# EAGLE design lcd (EAGLE 7.2.0)
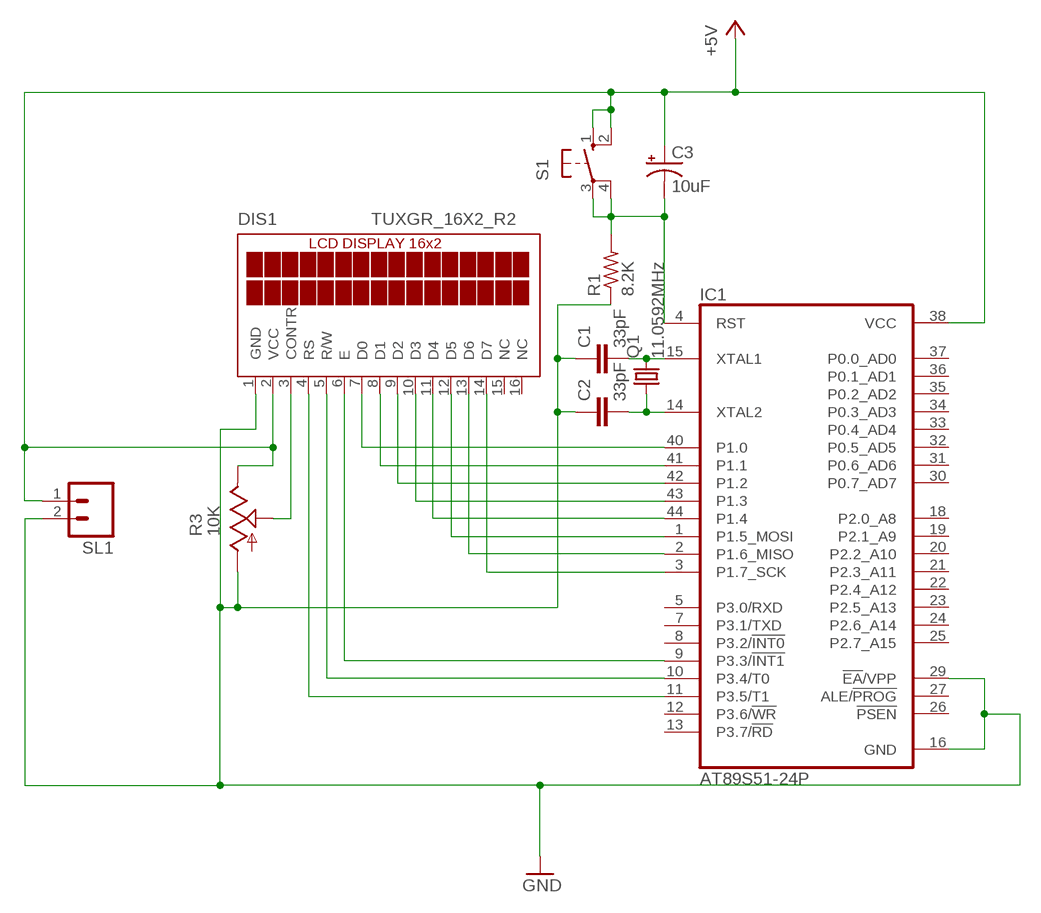
[diagram p0: schematic, sheet 1]

## Parts
C1  33pF  C-EUC1206K  [C1206K]
C2  33pF  C-EUC1206K  [C1206K]
C3  10uF  CPOL-US140CLH-1010  [140CLH-1010]
DIS1  TUXGR_16X2_R2  [TUXGR_16X2_R2]
IC1  AT89S51-24P  [TQFP44]
Q1  11.0592MHz  CRYSTALTC26V  [TC26V]
R1  8.2K  R-US_M1206  [M1206]
R3  10K  TRIM_US-B25U  [B25U]
S1  10-XX  [B3F-10XX]
SL1  MA02  [02PA]

## Nets
+5V: C3.+ DIS1.2(VCC) IC1.38(VCC) R3.E S1.1(S) S1.2(S1) SL1.1
GND: C1.1 C2.1 DIS1.1(GND) IC1.16(GND) IC1.29(!EA!/VPP) R1.1 R3.A SL1.2
N$1: C1.2 IC1.15(XTAL1) Q1.2
N$2: C2.2 IC1.14(XTAL2) Q1.1
N$3: DIS1.5(R/W) IC1.10(P3.4/T0)
N$4: DIS1.7(D0) IC1.40(P1.0)
N$5: DIS1.6(E) IC1.9(P3.3/!INT1)
N$6: DIS1.8(D1) IC1.41(P1.1)
N$7: DIS1.9(D2) IC1.42(P1.2)
N$9: DIS1.4(RS) IC1.11(P3.5/T1)
N$10: DIS1.10(D3) IC1.43(P1.3)
N$11: DIS1.11(D4) IC1.44(P1.4)
N$12: DIS1.12(D5) IC1.1(P1.5_MOSI)
N$13: DIS1.13(D6) IC1.2(P1.6_MISO)
N$14: DIS1.14(D7) IC1.3(P1.7_SCK)
N$15: DIS1.3(CONTR) R3.S
N$18: C3.- IC1.4(RST) R1.2 S1.3(P) S1.4(P1)
Unconnected: DIS1.15(NC) DIS1.16(NC) IC1.5(P3.0/RXD) IC1.7(P3.1/TXD) IC1.8(P3.2/!INT0) IC1.12(P3.6/!WR) IC1.13(P3.7/!RD) IC1.18(P2.0_A8) IC1.19(P2.1_A9) IC1.20(P2.2_A10) IC1.21(P2.3_A11) IC1.22(P2.4_A12) IC1.23(P2.5_A13) IC1.24(P2.6_A14) IC1.25(P2.7_A15) IC1.26(!PSEN) IC1.27(ALE/!PROG) IC1.30(P0.7_AD7) IC1.31(P0.6_AD6) IC1.32(P0.5_AD5) IC1.33(P0.4_AD4) IC1.34(P0.3_AD3) IC1.35(P0.2_AD2) IC1.36(P0.1_AD1) IC1.37(P0.0_AD0)

## Power pins joined to a net without a drawn wire
GND: IC1.17(GND)

## Library data of the parts
C1 C2 = rcl:C-EU: CAPACITOR, European symbol
C3 = rcl:CPOL-US: POLARIZED CAPACITOR, American symbol
DIS1 = display-lcd:TUXGR_16X2_R2: Tuxgraphics LCD display 16x2 characters reflective, without background light Source: tuxgr_12x2_r2.pdf; OC_FARNELL: unknown; OC_NEWARK: unknown
IC1 = atmel:AT89S51*P: 8-bit Microcontroller with 4K BytesIn-System Programmable Flash Source: http://www.atmel.com/dyn/resources/prod_documents/doc2487.pdf; OC_FARNELL: unknown; OC_NEWARK: unknown
Q1 = crystal:CRYSTAL: CRYSTAL; OC_FARNELL: unknown; OC_NEWARK: unknown
R1 = rcl:R-US_: RESISTOR, American symbol
R3 = pot:TRIM_US-: POTENTIOMETER
S1 = switch-omron:10-XX: OMRON SWITCH; MPN: B3F-1000; OC_FARNELL: 176432; OC_NEWARK: 36M3542
SL1 = con-amp-quick:MA02: AMP QUICK CONNECTOR; OC_FARNELL: unknown; OC_NEWARK: unknown

## Board
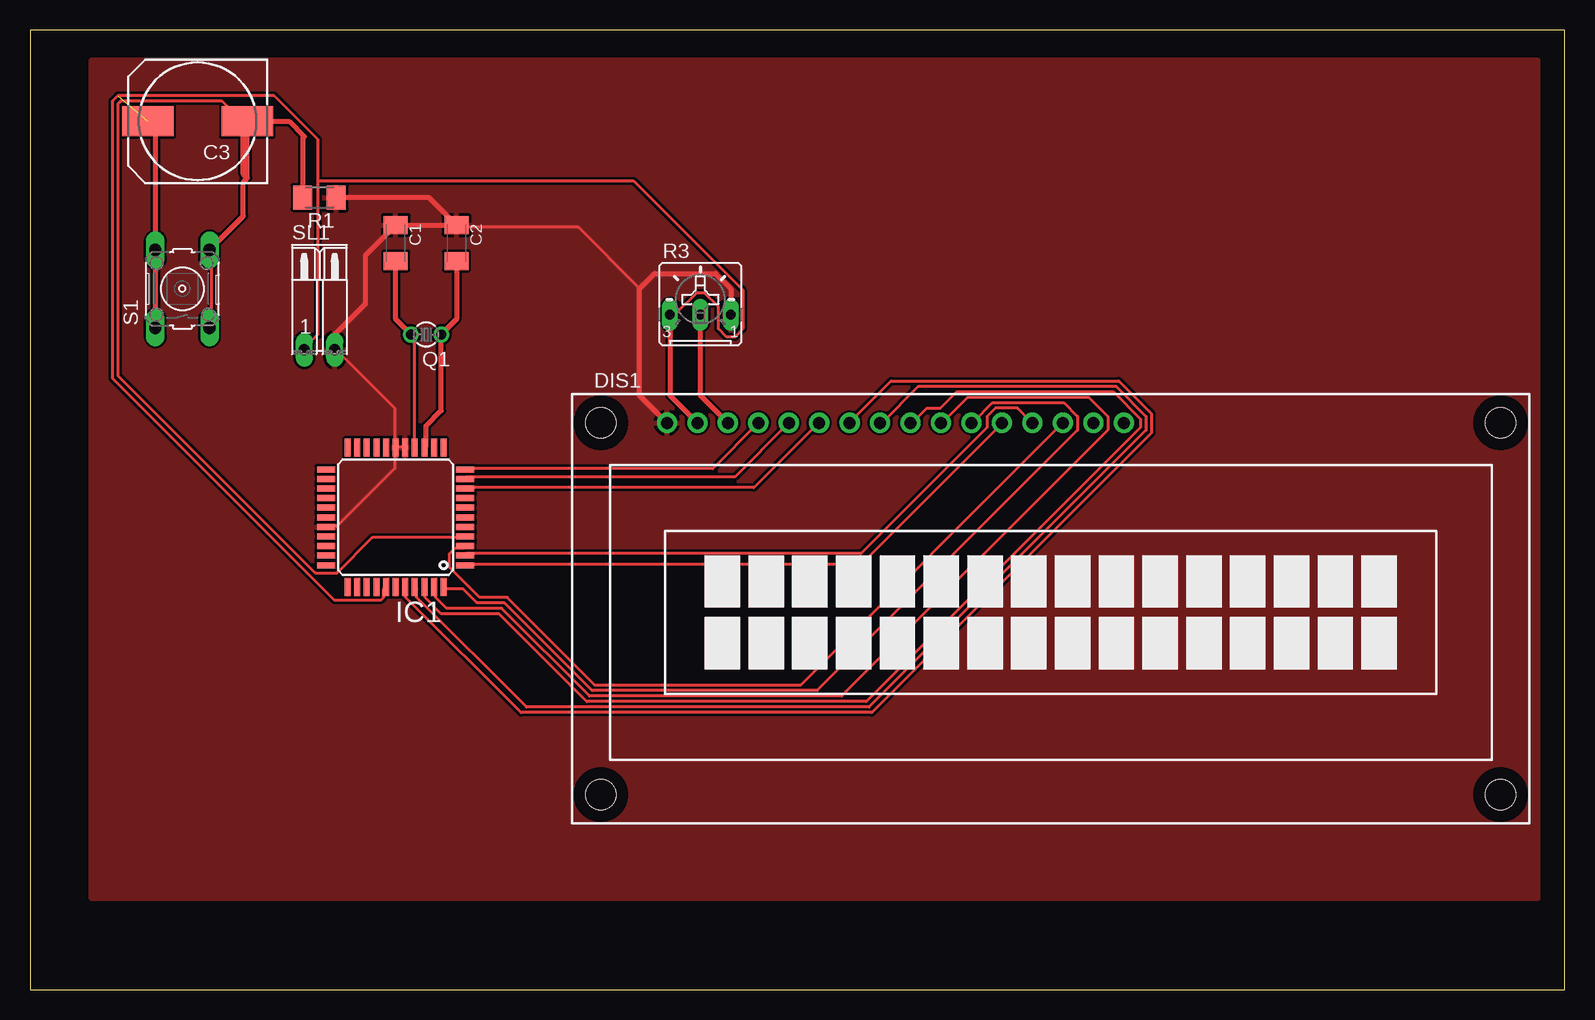
[diagram p1: board, top side]

Size 127.94 x 80 mm. Coordinates in mm from the lower left corner, seen from the top.
Outline: 0,0 127.94,0 127.94,80 0,80 0,0
Copper layers (1*16): Top 0.035mm / dielectric 1.5mm / Bottom 0.035mm
Design rules "default": minimum track width 10mil, minimum drill 24mil, track to track 8mil, track to pad 8mil, pad to pad 8mil, via to via 8mil, smd to smd 8mil, copper to edge 40mil, drill to drill 8mil, minimum pad ring 10mil, minimum via ring 8mil, stop-mask expansion 4mil, vias tented up to drill 0mil, thermal gap 10mil

### Footprints (pad centres in the part's own frame; a part is rotated, then mirrored left to right if it is on the bottom)
C1206K = smd 1.5 x 2: 1 -1.5,0; 2 1.5,0
140CLH-1010 = smd 4.3 x 2.5: + 4.15,0; - -4.15,0
TUXGR_16X2_R2 = drill 1 pad 1.676: 1 -32,15.5; 2 -29.46,15.5; 3 -26.92,15.5; 4 -24.38,15.5; 5 -21.84,15.5; 6 -19.3,15.5; 7 -16.76,15.5; 8 -14.22,15.5; 9 -11.68,15.5; 10 -9.14,15.5; 11 -6.6,15.5; 12 -4.06,15.5; 13 -1.52,15.5; 14 1.02,15.5; 15 3.56,15.5; 16 6.1,15.5 | hole 2.5: -37.5,-15.5; 37.5,-15.5; -37.5,15.5; 37.5,15.5
TQFP44 = smd 1.5 x 0.5: 1 -5.8,4; 2 -5.8,3.2; 3 -5.8,2.4; 4 -5.8,1.6; 5 -5.8,0.8; 6 -5.8,0; 7 -5.8,-0.8; 8 -5.8,-1.6; 9 -5.8,-2.4; 10 -5.8,-3.2; 11 -5.8,-4; 23 5.8,-4; 24 5.8,-3.2; 25 5.8,-2.4; 26 5.8,-1.6; 27 5.8,-0.8; 28 5.8,0; 29 5.8,0.8; 30 5.8,1.6; 31 5.8,2.4; 32 5.8,3.2; 33 5.8,4 | smd 0.5 x 1.5: 12 -4,-5.8; 13 -3.2,-5.8; 14 -2.4,-5.8; 15 -1.6,-5.8; 16 -0.8,-5.8; 17 0,-5.8; 18 0.8,-5.8; 19 1.6,-5.8; 20 2.4,-5.8; 21 3.2,-5.8; 22 4,-5.8; 34 4,5.8; 35 3.2,5.8; 36 2.4,5.8; 37 1.6,5.8; 38 0.8,5.8; 39 0,5.8; 40 -0.8,5.8; 41 -1.6,5.8; 42 -2.4,5.8; 43 -3.2,5.8; 44 -4,5.8
TC26V = drill 0.813: 1 -1.27,0; 2 1.27,0
M1206 = smd 1.6 x 2: 1 -1.4,0; 2 1.4,0
B25U = drill 0.813 long: A 2.54,-0.889; E -2.54,-0.889; S 0,-0.889
B3F-10XX = drill 1.016 long: 1 -3.251,2.261; 2 3.251,2.261; 3 -3.251,-2.261; 4 3.251,-2.261
02PA = drill 0.914 long: 1 -1.27,0; 2 1.27,0

### Placement (x,y rotation side)
C1  30.48,62.23 270 top
C2  35.56,62.23 270 top
C3  13.97,72.39 180 top
DIS1  85.09,31.75 0 top
IC1  30.48,39.37 180 top
Q1  33.02,54.61 180 top
R1  24.13,66.04 180 top
R3  55.88,57.15 0 top
S1  12.7,58.42 90 top
SL1  24.13,53.34 0 top

### Tracks (layer width: path | path; a pad name or v marks a point on that pad's centre or on a via)
+5V  (1 unrouted)
  Top 0.254: 24,67.44 24,54.63 22.86,53.49 SL1.1 | 24,67.44 24,70.87 20.34,74.52 7.32,74.52 6.86,74.07 6.86,50.98 25.38,32.46 29.26,32.46 29.49,32.69 29.49,33.38 IC1.38 | 24,67.44 50.29,67.44 59.44,58.29 59.44,55.09 58.75,54.41 58.06,54.41 57.38,55.09 57.38,56.92 56.24,58.06 55.55,58.06 53.95,56.46 53.49,56.46 R3.E
  Top 0.406: R3.E 53.34,49.54 DIS1.2 55.88,47 55.88,46.99 | C3.+ 10.44,71.77 S1.2 | S1.2 10.16,61.95 10.16,62.23 | S1.2 S1.1
GND
  Top 0.254: IC1.29 24.69,38.63 25.6,38.63 30.4,43.43 30.4,45.03 IC1.17 | C2.1 35.66,63.55 45.72,63.55 50.75,58.52 50.8,58.42 | IC1.16 31.09,45.26 30.63,45.26 IC1.17 | IC1.17 30.4,45.26 30.4,48.46 25.6,53.26 SL1.2
  Top 0.406: DIS1.1 50.8,49.54 50.8,58.42 52.07,59.69 57.15,59.69 58.42,58.42 R3.A | R1.1 33.25,66.04 C2.1 C1.1 27.94,61.19 27.94,57.15 25.4,54.61 SL1.2
  pour Top: 5.08,77.47 5.08,7.62 125.73,7.62 125.73,77.47
N$1
  Top 0.254: IC1.15 32,45.26 32,54.18 31.77,54.41 Q1.2
  Top 0.406: Q1.2 30.48,55.88 C1.2
N$2
  Top 0.406: C2.2 35.56,55.88 Q1.1 34.29,48.26 33.02,46.99 33.02,45.31 IC1.14
N$3
  Top 0.254: IC1.10 36.35,42.75 58.75,42.75 63.09,47.09 DIS1.5
N$4
  Top 0.254: IC1.40 31.32,33.38 31.32,32.69 40.92,23.09 70.18,23.09 93.5,46.41 93.5,48.01 90.75,50.75 71.78,50.75 68.35,47.32 DIS1.7
N$5
  Top 0.254: IC1.9 36.35,41.83 60.35,41.83 65.61,47.09 DIS1.6
N$6
  Top 0.254: IC1.41 32.23,33.38 32.23,32.69 41.38,23.55 69.95,23.55 93.04,46.63 93.04,47.78 90.53,50.29 74.07,50.29 71.09,47.32 DIS1.8
N$7
  Top 0.254: IC1.42 32.92,33.38 32.92,32.69 34.29,31.32 39.09,31.32 46.41,24 69.72,24 92.58,46.86 92.58,47.55 90.3,49.84 77.27,49.84 75.89,48.46 74.75,48.46 73.61,47.32 DIS1.9
N$9
  Top 0.254: IC1.11 36.35,43.43 56.92,43.43 60.58,47.09 DIS1.4
N$10
  Top 0.254: IC1.43 33.83,33.38 33.83,32.69 34.75,31.77 39.32,31.77 46.63,24.46 67.67,24.46 89.84,46.63 89.84,47.78 88.24,49.38 78.18,49.38 76.12,47.32 DIS1.10
N$11
  Top 0.254: IC1.44 34.52,33.38 36.12,33.38 37.26,32.23 39.55,32.23 46.86,24.92 65.61,24.92 87.33,46.63 87.33,47.78 86.18,48.92 80.24,48.92 78.64,47.32 DIS1.11
N$12
  Top 0.254: IC1.1 36.35,35.43 69.27,35.43 80.92,47.09 DIS1.12
N$13
  Top 0.254: IC1.2 36.35,36.35 69.27,36.35 79.78,46.86 79.78,47.78 80.47,48.46 82.3,48.46 83.44,47.32 DIS1.13
N$14
  Top 0.254: IC1.3 36.12,36.8 35.43,36.8 34.98,36.35 34.98,35.2 37.49,32.69 39.78,32.69 47.09,25.38 64.24,25.38 85.95,47.09 DIS1.14
N$15
  Top 0.406: DIS1.3 55.88,49.54 R3.S
N$18
  Top 0.254: IC1.4 36.12,37.72 28.57,37.72 25.6,34.75 23.77,34.75 7.32,51.21 7.32,73.84 7.54,74.07 16,74.07 17.6,72.47 C3.- | S1.3 15.09,55.32 15.09,61.49 S1.4
  Top 0.406: S1.4 17.78,64.49 17.78,67.31 18.12,67.65 | 18.12,67.65 C3.- | 18.12,67.65 17.78,67.99 17.78,72.39 C3.- | C3.- 21.59,72.39 22.86,71.12 22.73,70.99 R1.2